# Altium schematic sheet Power.SchDoc
size A4; Organization: Altium Limited; Address1: L3, 12a Rodborough Rd; Address2: Frenchs Forest; Address3: NSW; Address4: Australia 2086
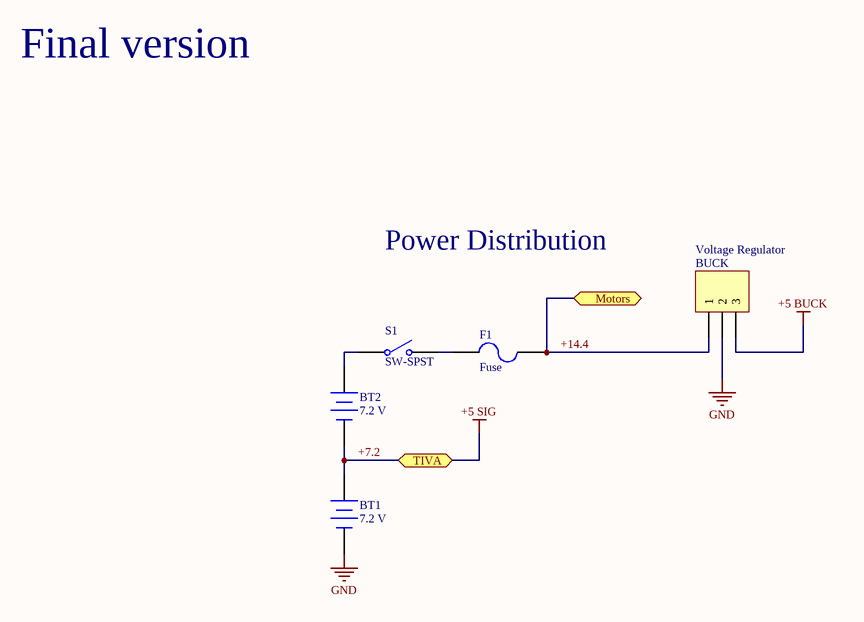
[diagram p0: Power.SchDoc]

## Parts
BT1  7.2 V  [BAT-2]
BT2  7.2 V  [BAT-2]
BUCK  Voltage Regulator  [HDR1X3]
F1  Fuse  [PIN-W2/E2.8]
S1  SW-SPST  [SPST-2]

## Ports
Motors, TIVA

## Nets
+5 BUCK: BUCK.3
+7.2: BT1.1(+) BT2.2(-) ; port TIVA  [also labelled +5 SIG]
GND: BT1.2(-) BUCK.2
+14.4: BUCK.1 F1.2 ; port Motors
NetBT2_1: BT2.1(+) S1.1(COMMON)
NetF1_1: F1.1 S1.2(NO)

## Notes on the sheet
- Final version
- Power Distribution
- Title
- Size:
- Date:
- A4
- Number:
- Time:
- Revision:
- Sheet
- of
- File:

## Library data of the parts
BT1 BT2 = Battery: Multicell Battery; Manufacturer: Generic Components; Published: 1999
BUCK = Molex3: Header, 3-Pin; Manufacturer: Generic Components; Class: Connector
F1 = Fuse 2: Manufacturer: Generic Components; Class: Passive; Published: 08/06/2000; Publisher: Altium Hobart Technology Centre; SubClass: Fuse
S1 = SW-SPST: Single-Pole, Single-Throw Switch; Manufacturer: Generic Components; Published: 1999